# EAGLE board SSS_SOB_REPRO (EAGLE 9.6.2), part 1 of 2
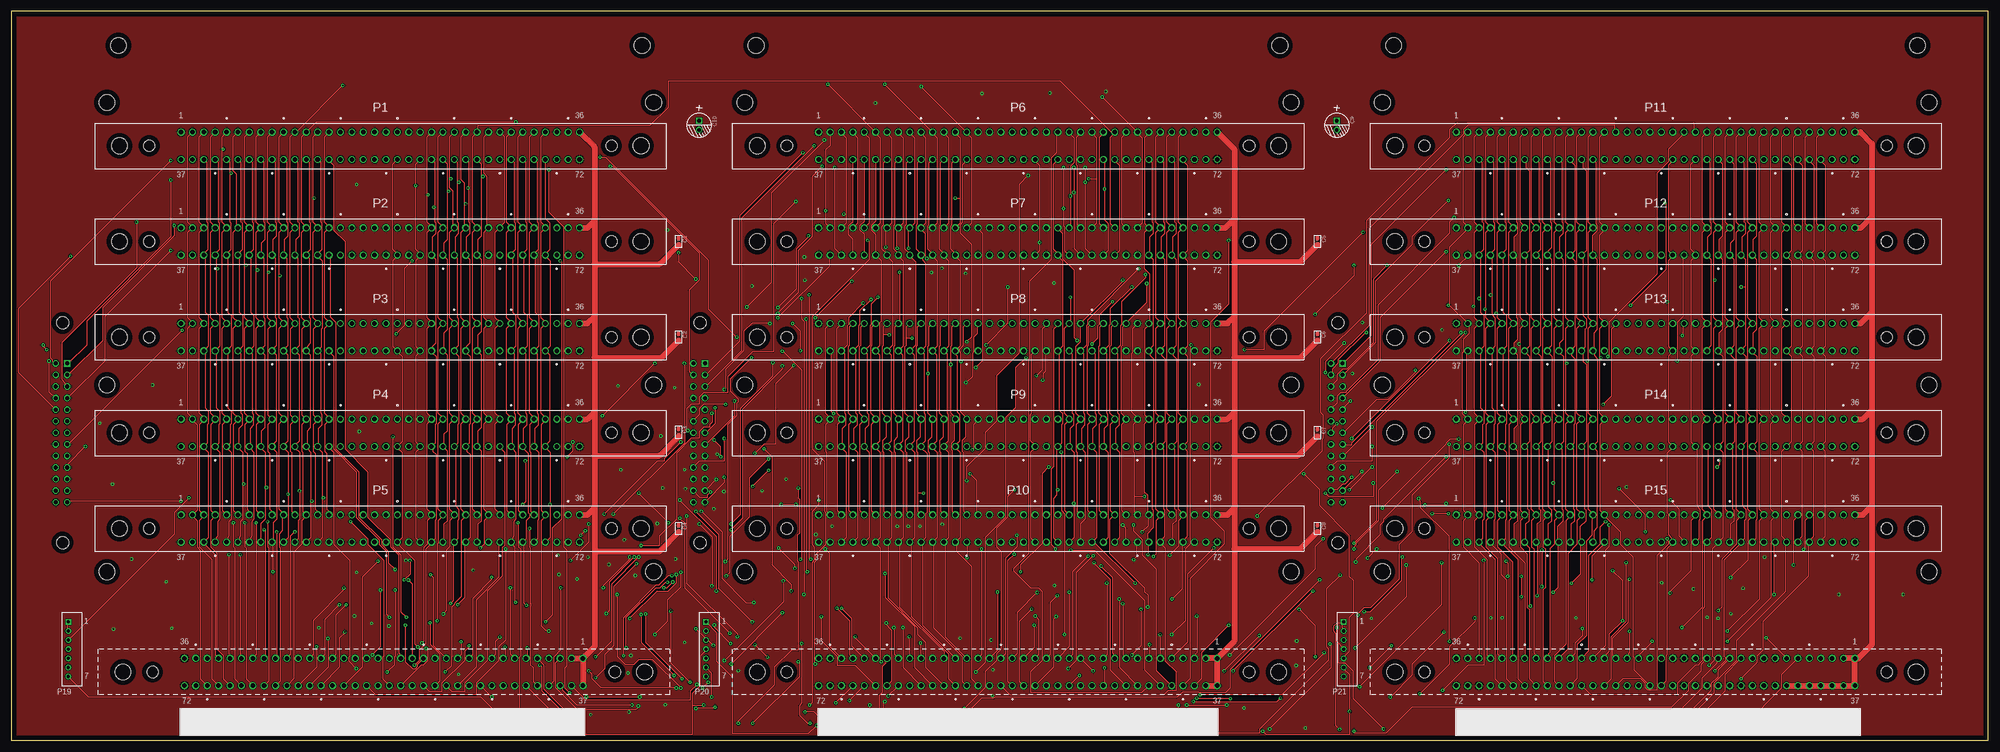
[diagram p3: board, top side]
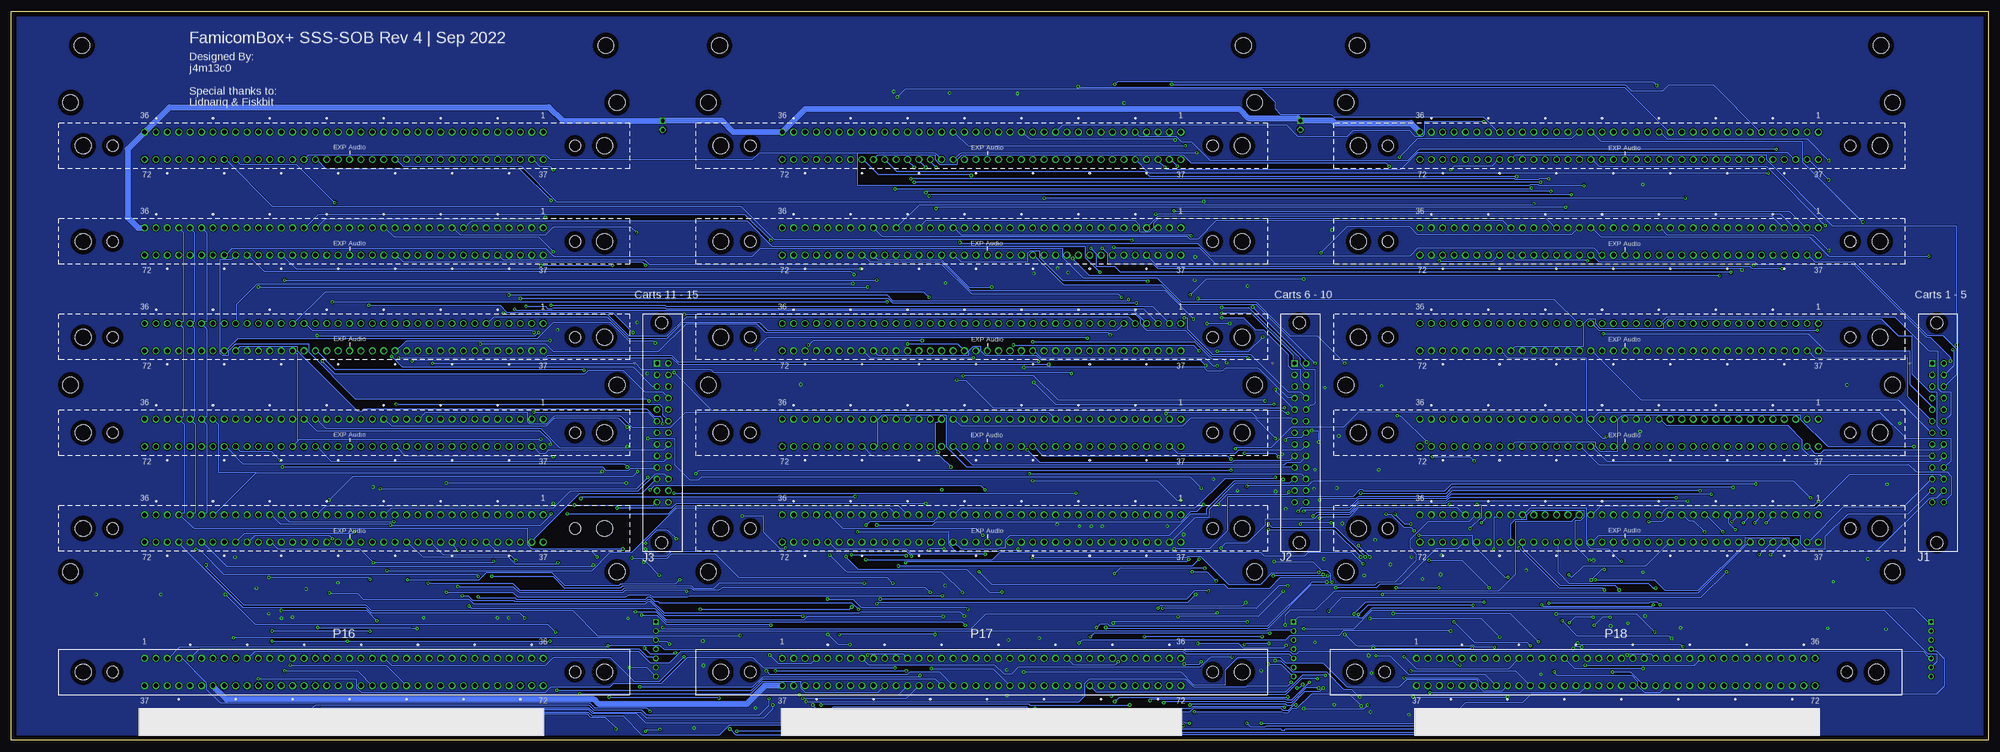
[diagram p4: board, bottom side, seen from below]

Size 434 x 160 mm. Coordinates in mm from the lower left corner, seen from the top.
Outline: 0,0 434,0 434,160 0,160 0,0
Copper layers (1*16): Top 0.035mm / dielectric 1.5mm / Bottom 0.035mm
Design rules "default *": minimum track width 6mil, minimum drill 0.3mm, track to track 6mil, track to pad 6mil, pad to pad 6mil, via to via 6mil, smd to smd 6mil, copper to edge 40mil, drill to drill 6mil, minimum pad ring 10mil, minimum via ring 8mil, stop-mask expansion 4mil, vias tented up to drill 0.3mm, thermal gap 10mil
Holes 3.5 mm at 23.5,152.5 138.5,152.5 163.5,152.5 278.5,152.5 303.5,152.5 418.5,152.5 21,37 21,78 21,140 421,37 421,78 421,140 141,140 141,78 141,37 161,140 161,78 161,37 281,140 281,78 281,37 301,140 301,78 301,37

## Footprints (pad centres in the part's own frame; a part is rotated, then mirrored left to right if it is on the bottom)
C0603 = smd 0.889 x 0.889: 1 0,0.762; 2 0,-0.762
PC-D5.3MM = drill 0.8 pad 1.35 square: + -1,0 | drill 0.8 pad 1.35: - 1,0
TE_2-5499206-6 = drill 0.89 square: 1 -15.24,-1.27 | drill 0.89: 2 -15.24,1.27; 3 -12.7,-1.27; 4 -12.7,1.27; 5 -10.16,-1.27; 6 -10.16,1.27; 7 -7.62,-1.27; 8 -7.62,1.27; 9 -5.08,-1.27; 10 -5.08,1.27; 11 -2.54,-1.27; 12 -2.54,1.27; 13 0,-1.27; 14 0,1.27; 15 2.54,-1.27; 16 2.54,1.27; 17 5.08,-1.27; 18 5.08,1.27; 19 7.62,-1.27; 20 7.62,1.27; 21 10.16,-1.27; 22 10.16,1.27; 23 12.7,-1.27; 24 12.7,1.27; 25 15.24,-1.27; 26 15.24,1.27 | hole 2.69: -24.13,-0.25; 24.13,-0.25
72PIN = drill 1: 1 0,6; 2 2.5,6; 3 5,6; 4 7.5,6; 5 10,6; 6 12.5,6; 7 15,6; 8 17.5,6; 9 20,6; 10 22.5,6; 11 25,6; 12 27.5,6; 13 30,6; 14 32.5,6; 15 35,6; 16 37.5,6; 17 40,6; 18 42.5,6; 19 45,6; 20 47.5,6; 21 50,6; 22 52.5,6; 23 55,6; 24 57.5,6; 25 60,6; 26 62.5,6; 27 65,6; 28 67.5,6; 29 70,6; 30 72.5,6; 31 75,6; 32 77.5,6; 33 80,6; 34 82.5,6; 35 85,6; 36 87.5,6; 37 0,0; 38 2.5,0; 39 5,0; 40 7.5,0; 41 10,0; 42 12.5,0; 43 15,0; 44 17.5,0; 45 20,0; 46 22.5,0; 47 25,0; 48 27.5,0; 49 30,0; 50 32.5,0; 51 35,0; 52 37.5,0; 53 40,0; 54 42.5,0; 55 45,0; 56 47.5,0; 57 50,0; 58 52.5,0; 59 55,0; 60 57.5,0; 61 60,0; 62 62.5,0; 63 65,0; 64 67.5,0; 65 70,0; 66 72.5,0; 67 75,0; 68 77.5,0; 69 80,0; 70 82.5,0; 71 85,0; 72 87.5,0 | hole 2.5: -7,3; 94.5,3 | hole 3.5: 101,3; -13.5,3
7PIN_LED = drill 0.7 square: P$1 2,1.5 | drill 0.7: P$2 4,1.5; P$3 6,1.5; P$4 8,1.5; P$5 10,1.5; P$6 12,1.5; P$7 14,1.5

## Placement (x,y rotation side)
C1  100nf  [C0603]  146.5,109.5 0 top
C2  100nf  [C0603]  146.5,88.5 0 top
C3  100nf  [C0603]  146.5,67.6 0 top
C4  100nf  [C0603]  146.5,46.5 0 top
C5  100nf  [C0603]  286.75,109.5 0 top
C6  100nf  [C0603]  286.75,88.5 0 top
C7  100nf  [C0603]  286.75,67.5 0 top
C8  100nf  [C0603]  286.75,46.5 0 top
C9  220uf 10V  [PC-D5.3MM]  291,135 270 top
C10  220uf 10V  [PC-D5.3MM]  151,135 270 top
J1  2-5499206-6  [TE_2-5499206-6]  11,67.5 270 bottom
J2  2-5499206-6  [TE_2-5499206-6]  151,67.5 270 bottom
J3  2-5499206-6  [TE_2-5499206-6]  291,67.5 270 bottom
P1  CARTRIDGE_CONNECTOR  [72PIN]  37.25,127.5 0 top
P2  CARTRIDGE_CONNECTOR  [72PIN]  37.25,106.5 0 top
P3  CARTRIDGE_CONNECTOR  [72PIN]  37.25,85.5 0 top
P4  CARTRIDGE_CONNECTOR  [72PIN]  37.25,64.5 0 top
P5  CARTRIDGE_CONNECTOR  [72PIN]  37.25,43.5 0 top
P6  CARTRIDGE_CONNECTOR  [72PIN]  177.25,127.5 0 top
P7  CARTRIDGE_CONNECTOR  [72PIN]  177.25,106.5 0 top
P8  CARTRIDGE_CONNECTOR  [72PIN]  177.25,85.5 0 top
P9  CARTRIDGE_CONNECTOR  [72PIN]  177.25,64.5 0 top
P10  CARTRIDGE_CONNECTOR  [72PIN]  177.25,43.5 0 top
P11  CARTRIDGE_CONNECTOR  [72PIN]  317.25,127.5 0 top
P12  CARTRIDGE_CONNECTOR  [72PIN]  317.25,106.5 0 top
P13  CARTRIDGE_CONNECTOR  [72PIN]  317.25,85.5 0 top
P14  CARTRIDGE_CONNECTOR  [72PIN]  317.25,64.5 0 top
P15  CARTRIDGE_CONNECTOR  [72PIN]  317.25,43.5 0 top
P16  P16_CONNECTOR  [72PIN]  404.75,12 0 bottom
P17  P17_CONNECTOR  [72PIN]  264.75,12 0 bottom
P18  P18_CONNECTOR  [72PIN]  125.5,12 0 bottom
P19  LED_BOARD_CONNECTOR  [7PIN_LED]  11,28 270 top
P20  LED_BOARD_CONNECTOR  [7PIN_LED]  151,28 270 top
P21  LED_BOARD_CONNECTOR  [7PIN_LED]  291,28 270 top

## Tracks (layer width: path | path; a pad name or v marks a point on that pad's centre or on a via)
/W_B1  (via drill 0.3)
  Top 0.152: P18.53 90,16.5 90.39,16.5 91.5,17.61 91.5,19.75 v91.1,20.15 | v89.25,20.5 88.5,21.25 88.5,39.5 84.75,43.25 P5.56 85.75,44.5 85.75,63.25 84.75,64.25 P4.56 85.75,65.5 85.75,84.25 84.75,85.25 P3.56 83.75,86.5 83.75,105.25 84.75,106.25 P2.56 84.75,106.75 83.75,107.75 83.75,126.5 P1.56 | P7.56 225.75,107.5 v225.75,109.25 225.75,126.25 224.75,127.25 P6.56
  Bottom 0.152: v91.1,20.15 90.75,20.5 v89.25,20.5 | v225.75,109.25 225.5,109 173.5,109 170.75,106.25 127,106.25 125.25,108 86.5,108 85,106.5 P2.56
/W_B2  (via drill 0.3)
  Top 0.152: P10.56 223.75,44.5 223.75,63.25 224.75,64.25 P9.56 224.75,64.75 223.75,65.75 223.75,71.5 224,71.75 224,84.75 P8.56 | P16.54 363.25,13 363.25,18.5 363.5,18.75 363.5,42 364.75,43.25 P15.56 364.5,43.75 364.5,44.5 363.75,45.25 363.75,49.75 363.5,50 363.5,63 364.75,64.25 P14.56 363.75,65.5 363.75,84.25 364.75,85.25 P13.56 363.75,86.5 363.75,96.25 | P11.56 364.75,127.25 363.75,126.25 363.75,107.5 P12.56 364.75,106.25 363.75,105.25 363.75,96.25 | v237.25,87 238.5,88.25 238.5,91 238.75,91.25 238.75,93.25 v241.75,96.25 | 363.75,96.25 v363.5,96.25
  Bottom 0.152: P8.56 226.25,87 v237.25,87 | v363.5,96.25 v241.75,96.25
A0_B1  (via drill 0.3)
  Top 0.152: P18.27 61.25,18.75 61.25,44.75 v62.25,45.75 | P7.13 208.25,113.5 208.25,119 | 208.25,119 208.25,132.25 207.25,133.25 P6.13 | P1.13 66.25,132.5 66.25,119 | 66.25,119 66.25,113.75 67.25,112.75 P2.13 66.25,111.5 66.25,92.75 67.25,91.75 P3.13 67.25,91.25 66.25,90.25 66.25,71.5 P4.13 67.25,70.25 66.25,69.25 66.25,63.5 66.75,63 66.75,50.75 67,50.5 67,49.75 P5.13 | v207.25,119 208.25,119 | 66.25,119 v66.5,119
  Bottom 0.152: v62.25,45.75 64.75,48.25 65.75,48.25 67,49.5 P5.13 | v66.5,119 v207.25,119
A0_B2  (via drill 0.3)
  Top 0.152: P10.13 206.5,50.25 206.5,63.65 206.25,63.9 206.25,65.05 207,65.8 207,70.25 P9.13 207.25,70.75 206.25,71.75 v206.25,82.5 206.25,86.5 206.5,86.75 206.5,90.75 P8.13 | P16.62 343.75,13.5 343.75,21 345.75,23 345.75,43.75 347,45 347,49.25 P15.13 347.25,49.75 346.25,50.75 346.25,69.5 P14.13 347.25,70.75 346.25,71.75 346.25,83.25 | 346.25,83.25 346.25,90.5 P13.13 347.25,91.75 346.25,92.75 346.25,111.5 P12.13 347.25,112.75 346.25,113.75 346.25,132.5 P11.13 | 346.25,83.25 v346,83.25
  Bottom 0.152: v206.25,82.5 287.5,82.5 289,84 316.25,84 316.75,83.5 345.75,83.5 v346,83.25
A1_B1  (via drill 0.3)
  Top 0.152: P18.63 62,13.5 62,41.25 63.75,43 63.75,48.25 64.75,49.25 P5.12 64,50.25 64,63.25 63.75,63.5 63.75,69.25 64.75,70.25 P4.12 63.75,71.5 63.75,90.25 64.75,91.25 P3.12 64.75,91.75 63.75,92.75 63.75,111.5 P2.12 64.75,112.75 63.75,113.75 63.75,132.5 P1.12 67,135.75 v110.75,135.75 | P7.12 205.75,113.5 205.75,132.25 204.75,133.25 P6.12
  Bottom 0.152: P6.12 203.25,135 154,135 151.5,132.5 140.75,132.5 139.5,133.75 127,133.75 125.75,132.5 124.25,132.5 123.75,133 123.75,135.75 v110.75,135.75
A1_B2
  Top 0.152: P10.12 204,50.25 204,63.25 203.75,63.5 203.75,65.75 204.5,66.5 204.5,70.25 P9.12 204.75,70.75 203.75,71.75 203.75,86.5 204,86.75 204,90.75 P8.12 | P16.27 341.75,20 341.75,41 343.75,43 343.75,48.25 344.75,49.25 P15.12 344.75,49.75 343.75,50.75 343.75,69.5 P14.12 344.75,70.75 343.75,71.75 343.75,90.5 P13.12 344.75,91.75 343.75,92.75 343.75,111.5 P12.12 344.75,112.75 343.75,113.75 343.75,132.5 P11.12
  Bottom 0.152: P9.12 206.25,72 286,72 289.25,68.75 297.75,68.75 300.25,71.25 314.75,71.25 316.5,69.5 320.25,69.5 320.75,70 320.75,72 343,72 344.5,70.5 P14.12
A2_B1  (via drill 0.3)
  Top 0.152: P18.28 58.25,18.25 v58.25,45.75 | P7.11 203.25,113.5 203.25,132.25 202.25,133.25 P6.11 v191.75,144 | v72.75,143.75 62.5,133.5 P1.11 61.25,132.5 61.25,113.75 62.25,112.75 P2.11 61.25,111.5 61.25,92.75 62.25,91.75 P3.11 62.25,91.25 61.25,90.25 61.25,71.5 P4.11 62.25,70.25 61.25,69.25 61.25,63.5 61.5,63.25 61.5,50.25 P5.11
  Bottom 0.152: v58.25,45.75 62,49.5 P5.11 | v72.75,143.75 73.4,144.4 178.79,144.4 179,144.61 191.14,144.61 v191.75,144
A2_B2  (via drill 0.3)
  Top 0.152: P10.11 201.5,50.25 201.5,63.25 201.25,63.5 201.25,65.75 202,66.5 202,70.25 P9.11 202.25,70.75 201.25,71.75 v201.25,80.5 201.25,86.5 201.5,86.75 201.5,90.75 P8.11 | P16.63 338.75,13 338.75,18.55 341.25,21.05 341.25,48.25 342.25,49.25 P15.11 342.25,49.75 341.25,50.75 341.25,69.5 P14.11 342.25,70.75 341.25,71.75 341.25,82.75 | 341.25,82.75 341.25,90.5 P13.11 342.25,91.75 341.25,92.75 341.25,111.5 P12.11 342.25,112.75 341.25,113.75 341.25,132.5 P11.11 | 341.25,82.75 v341.5,82.75
  Bottom 0.152: v201.25,80.5 201.55,80.8 279.8,80.8 280.5,81.5 295.75,81.5 297,82.75 v341.5,82.75
A3_B1  (via drill 0.3)
  Top 0.152: P6.10 199.75,133.25 200.75,132.25 200.75,113.5 P7.10 199.75,112.2 200.75,111.2 200.75,106.25 201,106 v201,105.75 | P18.64 59,13 59,42.25 58.75,42.5 58.75,45.25 59.5,46 59.5,49.25 P5.10 59.75,49.75 58.75,50.75 58.75,69.5 P4.10 59.75,70.75 58.75,71.75 58.75,90.5 P3.10 59.75,91.75 58.75,92.75 58.75,102 | 58.75,102 58.75,111.5 P2.10 59.75,112.75 58.75,113.75 58.75,132.5 P1.10 | 58.75,102 v59,102
  Bottom 0.152: v201,105.75 197.25,102 v59,102
A3_B2  (via drill 0.3)
  Top 0.152: P10.10 199,50.25 199,54.25 | 199,54.25 199,63.25 198.75,63.5 198.75,65.75 199.5,66.5 199.5,70.25 P9.10 199.75,70.75 198.75,71.75 198.75,86.5 199,86.75 199,90.75 P8.10 | P16.28 337.5,18.25 337.5,19 337.75,19.25 337.75,42 338.75,43 338.75,48.25 339.75,49.25 P15.10 339.75,49.75 338.75,50.75 338.75,56.5 | 338.75,56.5 338.75,69.5 P14.10 339.75,70.75 338.75,71.75 338.75,90.5 P13.10 339.75,91.75 338.75,92.75 338.75,111.5 P12.10 339.75,112.75 338.75,113.75 338.75,132.5 P11.10 | v200.25,54.25 199,54.25 | v288.5,54.25 289.25,53.5 299,53.5 v299,56.5 | 338.75,56.5 v338.5,56.5
  Bottom 0.152: v288.5,54.25 v200.25,54.25 | v338.5,56.5 v299,56.5
A4_B1  (via drill 0.3)
  Top 0.152: P18.29 55.75,18.25 55.75,46 v55.5,46.25 | P6.9 197.25,133.25 198.25,132.25 198.25,113.5 P7.9 197,112.25 v197,108 | 56.25,102.75 56.25,92.75 57.25,91.75 P3.9 57.25,91.25 56.25,90.25 56.25,71.5 P4.9 57.25,70.25 56.25,69.25 56.25,63.5 56.75,63 56.75,50.75 57,50.5 57,49.75 P5.9 | 56.25,102.75 56.25,111.5 P2.9 57.25,112.75 56.25,113.75 56.25,132.5 P1.9 | 56.25,102.75 v56.5,102.75
  Bottom 0.152: v55.5,46.25 57,47.75 57,49.5 P5.9 | v197,108 195.75,106.75 195.75,104 191.75,104 190.5,102.75 v56.5,102.75
A4_B2  (via drill 0.3)
  Top 0.152: P10.9 196.5,50.25 196.5,63.25 196.25,63.5 196.25,65.75 197,66.5 197,70.25 P9.9 197.25,70.75 196.25,71.75 196.25,86.5 196.5,86.75 196.5,88.25 | P8.9 196.5,90.75 196.5,88.25 | P16.64 336.25,13 336.25,33 336.75,33.5 336.75,42 336.25,42.5 336.25,48.25 337.25,49.25 P15.9 337.25,49.75 336.25,50.75 336.25,69.5 P14.9 337.25,70.75 336.25,71.75 336.25,90.5 P13.9 337.25,91.75 336.25,92.75 336.25,111.5 P12.9 337.25,112.75 336.25,113.75 336.25,132.5 P11.9 | v197.75,88.25 196.5,88.25 | v270.75,85.75 275,85.75 275,89.75 v296.75,111.5
  Bottom 0.152: v197.75,88.25 198,88.5 268,88.5 v270.75,85.75 | v296.75,111.5 298,112.75 315,112.75 316.75,111 335.5,111 337,112.5 P12.9
A5_B1  (via drill 0.3)
  Top 0.152: P6.8 194.75,133.25 195.75,132.25 195.75,113.5 P7.8 194.5,112.25 v194.5,108 | P5.8 53.75,50.5 53.75,69.25 54.75,70.25 P4.8 54.75,70.75 53.75,71.75 53.75,90.5 P3.8 54.75,91.75 53.75,92.75 53.75,103.25 | 53.75,103.25 53.75,111.5 P2.8 54.75,112.75 53.75,113.75 53.75,132.5 P1.8 | P18.65 56.5,13 56.5,42.25 56.25,42.5 v56.25,48 | 53.75,103.25 v54,103.25
  Bottom 0.152: P5.8 v56.25,48 | v194.5,108 193.25,106.75 193.25,104.5 183.25,104.5 182.25,103.5 54.25,103.5 v54,103.25
A5_B2  (via drill 0.3)
  Top 0.152: P10.8 194,50.25 194,63.25 193.75,63.5 193.75,65.75 194.5,66.5 194.5,70.25 P9.8 194.75,70.75 193.75,71.75 193.75,86.5 194,86.75 194,90.75 P8.8 195,91.75 v195,102.75 | P16.29 334.5,18.25 334.5,19 334.25,19.25 334.25,42 333.75,42.5 333.75,48.25 334.75,49.25 P15.8 334.75,49.75 333.75,50.75 333.75,69.5 P14.8 334.75,70.75 333.75,71.75 333.75,90.5 P13.8 334.75,91.75 333.75,92.75 333.75,111.5 P12.8 334.75,112.75 333.75,113.75 333.75,132.5 P11.8
  Bottom 0.152: v195,102.75 198.25,106 198.25,108.5 267,108.5 272.5,114 333,114 334.5,112.5 P12.8
A6_B1  (via drill 0.3)
  Top 0.152: P6.7 192.25,133.25 193.25,132.25 193.25,113.5 P7.7 192,112.25 v192,108.25 | P5.7 52,49.75 52,50.5 51.75,50.75 51.75,63 51.25,63.5 51.25,69.25 52.25,70.25 P4.7 52.25,70.75 51.25,71.75 51.25,90.5 P3.7 52.25,91.75 51.25,92.75 51.25,104.25 | 51.25,104.25 51.25,111.5 P2.7 52.25,112.75 51.25,113.75 51.25,132.5 P1.7 | P18.30 53.75,18.75 v53.75,47.75 | 51.25,104.25 v51.5,104.25
  Bottom 0.152: v53.75,47.75 52.25,49.25 P5.7 | v192,108.25 191.75,108 173,108 169.5,104.5 51.75,104.5 v51.5,104.25
A6_B2  (via drill 0.3)
  Top 0.152: P10.7 191.5,50.25 191.5,63.25 191.25,63.5 191.25,65.75 192,66.5 192,70.25 P9.7 192.25,70.75 191.25,71.75 191.25,86.5 191.5,86.75 191.5,89 | P8.7 191.5,90.75 191.5,89 | 331.25,87 331.25,71.75 332.25,70.75 P14.7 332.25,70.25 331.25,69.25 331.25,50.5 P15.7 332.25,49.25 331.25,48.25 331.25,42.5 332.75,41 332.75,29.25 333.25,28.75 333.25,13.5 P16.65 | 331.25,87 331.25,90.5 P13.7 332.25,91.75 331.25,92.75 331.25,111.5 P12.7 332.25,112.75 331.25,113.75 331.25,132.5 P11.7 | v192.75,89 191.5,89 | 331.25,87 v331,87
  Bottom 0.152: v192.75,89 193.25,89.5 268.44,89.5 270.28,91.34 285.91,91.34 292,85.25 315,85.25 316.75,87 v331,87
A7_B1  (via drill 0.3)
  Top 0.152: P7.6 190.75,113.5 190.75,132.25 189.75,133.25 P6.6 v179.25,144 | P5.6 48.75,50.5 48.75,69.25 49.75,70.25 P4.6 49.75,70.75 48.75,71.75 48.75,90.5 P3.6 49.75,91.75 48.75,92.75 48.75,111.5 49.5,112.25 | P1.6 48.75,132.5 48.75,125 49.5,124.25 49.5,112.25 | 49.5,112.25 P2.6 | P18.66 51.5,13.5 51.5,42.25 51.25,42.5 v51.25,47.75
  Bottom 0.152: v51.25,47.75 49.75,49.25 P5.6 | v179.25,144 179,143.75 79.5,143.75 78.25,142.5 71.5,142.5 70.25,143.75 60.25,143.75 50,133.5 P1.6
A7_B2
  Top 0.152: P10.6 188.75,50.5 188.75,69.25 189.75,70.25 P9.6 189.75,70.75 188.75,71.75 188.75,86.5 189,86.75 189,90.75 P8.6 | P11.6 328.75,132.5 328.75,113.75 329.75,112.75 P12.6 328.75,111.5 328.75,92.75 329.75,91.75 P13.6 328.75,90.5 328.75,71.75 329.75,70.75 P14.6 329.75,70.25 328.75,69.25 328.75,50.5 P15.6 329.75,49.25 328.75,48.25 328.75,42.5 332.25,39 P16.30
  Bottom 0.152: P8.6 191.25,90 268,90 269.75,91.75 286.5,91.75 290,88.25 298.5,88.25 303.25,93 328,93 329.5,91.5 P13.6
A8_B1  (via drill 0.3)
  Top 0.152: P7.5 188.25,113.5 188.25,132.25 187.25,133.25 P6.5 | P5.5 46.25,50.5 46.25,69.25 47.25,70.25 P4.5 47.25,70.75 46.25,71.75 46.25,90.5 P3.5 47.25,91.75 46.25,92.75 46.25,111.5 P2.5 47.25,112.75 46.25,113.75 46.25,129.75 | P1.5 46.25,132.5 46.25,129.75 | P18.67 49,13.5 49,42.25 48.75,42.5 v48.75,47.75 | 46.25,129.75 v46.5,129.75
  Bottom 0.152: v48.75,47.75 47.25,49.25 P5.5 | P6.5 186.25,132.5 178.25,132.5 177,131.25 174.75,131.25 170.75,127.25 127.5,127.25 125,129.75 v46.5,129.75
A8_B2  (via drill 0.3)
  Top 0.152: P10.5 186.25,50.5 186.25,69.25 187.25,70.25 P9.5 187.25,70.75 186.25,71.75 186.25,86.5 186.5,86.75 186.5,90.75 P8.5 | 326.25,93.75 326.25,92.75 327.25,91.75 P13.5 326.25,90.5 326.25,71.75 327.25,70.75 P14.5 327.25,70.25 326.25,69.25 326.25,50.5 P15.5 327.25,49.25 326.25,48.25 326.25,42.5 329.5,39.25 329.5,18.25 P16.31 | 326.25,93.75 326.25,111.5 P12.5 327.25,112.75 326.25,113.75 326.25,132.5 P11.5 | 326.25,93.75 v326,93.75
  Bottom 0.152: P8.5 188.75,93 285.75,93 290,88.75 298.5,88.75 303.25,93.5 325.75,93.5 v326,93.75
A9_B1
  Top 0.152: P7.4 185.75,113.5 185.75,132.25 184.75,133.25 P6.4 | P1.4 43.75,132.5 43.75,113.75 44.75,112.75 P2.4 43.75,111.5 43.75,92.75 44.75,91.75 P3.4 43.75,90.5 43.75,71.75 44.75,70.75 P4.4 44.75,70.25 43.75,69.25 43.75,50.5 P5.4 44.75,49.25 43.75,48.25 43.75,42.5 45.08,41.17 45.08,20.12 46.5,18.7 46.5,13.5 P18.68
  Bottom 0.152: P7.4 182.25,115 47.5,115 45,112.5 P2.4
A9_B2  (via drill 0.3)
  Top 0.152: P10.4 183.75,50.5 183.75,69.25 184.75,70.25 P9.4 184.75,70.75 183.75,71.75 183.75,86.5 184,86.75 184,90.75 P8.4 | 323.75,94.65 323.75,92.75 324.75,91.75 P13.4 323.75,90.5 323.75,71.75 324.75,70.75 P14.4 324.75,70.25 323.75,69.25 323.75,50.5 P15.4 324.75,49.25 323.75,48.25 323.75,42.5 326.25,40 326.25,19 P16.32 | 323.75,94.65 323.75,111.5 P12.4 324.75,112.75 323.75,113.75 323.75,132.5 P11.4 | 323.75,94.65 v323.5,94.65
  Bottom 0.152: P8.4 187.6,94.35 323.2,94.35 v323.5,94.65
A10_B1  (via drill 0.3)
  Top 0.152: P7.3 183.25,113.5 183.25,115.5 | 183.25,115.5 183.25,132.25 182.25,133.25 P6.3 | P1.3 41.25,132.5 41.25,113.75 42.25,112.75 P2.3 41.25,111.5 41.25,92.75 42.25,91.75 P3.3 41.25,90.5 41.25,71.75 42.25,70.75 P4.3 42.25,70.25 41.25,69.25 41.25,50.5 P5.3 42.25,49.25 41.25,48.25 41.25,42.5 44,39.75 44,13.5 P18.69 | v182.75,115.5 183.25,115.5
  Bottom 0.152: v182.75,115.5 45.5,115.5 42.5,112.5 P2.3
A10_B2  (via drill 0.3)
  Top 0.152: P10.3 181.25,50.5 181.25,69.25 182.25,70.25 P9.3 182.25,70.75 181.25,71.75 181.25,90.5 P8.3 | P16.33 324,18.75 324,39.75 321.25,42.5 321.25,48.25 322.25,49.25 P15.3 321.25,50.5 321.25,69.25 322.25,70.25 P14.3 322.25,70.75 321.25,71.75 321.25,90.5 P13.3 322.25,91.75 321.25,92.75 321.25,95.25 | 321.25,95.25 321.25,111.5 P12.3 322.25,112.75 321.25,113.75 321.25,132.5 P11.3 | 321.25,95.25 v321,95.25
  Bottom 0.152: P8.3 185.5,94.75 290.25,94.75 290.5,95 315,95 315.25,94.75 316.25,94.75 316.75,95.25 v321,95.25
A11_B1  (via drill 0.3)
  Top 0.152: P7.2 178.75,113.5 v178.75,116.25 178.75,129.6 179.7,130.55 179.7,133.45 P6.2 | P1.2 38.75,132.5 38.75,113.75 39.75,112.75 P2.2 38.75,111.5 38.75,92.75 39.75,91.75 P3.2 38.75,90.5 38.75,71.75 39.75,70.75 P4.2 39.75,70.25 40.75,69.25 40.75,50.5 P5.2 39.75,49.25 40.75,48.25 40.75,42.5 41.5,41.75 41.5,13.5 P18.70
  Bottom 0.152: v178.75,116.25 178.5,116 43.5,116 40,112.5 P2.2
A11_B2  (via drill 0.3)
  Top 0.152: P16.34 322.25,39 318.75,42.5 318.75,48.25 319.75,49.25 P15.2 318.75,50.5 318.75,69.25 319.75,70.25 P14.2 318.5,71.75 318.5,85 318.75,85.25 318.75,88 320,89.25 320,91.25 P13.2 315.75,95.5 | P10.2 179,50.25 179,63.25 178.75,63.5 178.75,69.25 179.75,70.25 P9.2 179.75,70.75 178.75,71.75 178.75,90.5 P8.2 | 315.75,95.5 315.75,108.25 319.75,112.25 P12.2 319.75,112.75 318.75,113.75 318.75,132.5 P11.2 | 315.75,95.5 v315.5,95.5
  Bottom 0.152: P8.2 183.5,95.25 290.25,95.25 290.5,95.5 v315.5,95.5
A12_B1  (via drill 0.3)
  Top 0.152: P18.33 44.75,18.75 44.75,40.75 42.25,43.25 P5.39 43.25,44.5 43.25,63.25 42.25,64.25 P4.39 43,65.25 43,69.25 43.25,69.5 43.25,72.25 42.5,73 42.5,85.75 | P7.39 180.75,108 v180.75,125.75 | 42.5,85.75 43.25,86.5 43.25,93.25 42.5,94 42.5,106.25 P2.39 42.25,106.75 43.25,107.75 43.25,113.5 43,113.75 43,126.75 P1.39 | 42.5,85.75 P3.39
  Bottom 0.152: P6.39 182.25,127.25 v180.75,125.75 180.25,125.25 129,125.25 125.25,129 44,129 42.5,127.5 P1.39
A12_B2  (via drill 0.3)
  Top 0.152: P16.68 325.75,13.5 325.75,39.75 322.25,43.25 P15.39 323,44.25 323,48.25 323.25,48.5 323.25,63.25 322.25,64.25 P14.39 323,65.25 323,69.25 323.25,69.5 323.25,72.25 322.5,73 322.5,85.75 | P10.39 183.25,44.5 183.25,63.25 182.5,64 | 182.5,64 182.25,64.25 P9.39 182.5,64 | 182.5,64 182.5,68.5 183.25,69.25 183.25,71.5 183,71.75 183,84.75 P8.39 183.5,86.75 183.5,91 183.75,91.25 183.75,92.75 v187,96 | 322.5,85.75 323.25,86.5 323.25,93.25 322.5,94 322.5,97 | 322.5,97 322.5,106.25 P12.39 322.25,106.75 323.25,107.75 323.25,113.5 323,113.75 323,126.75 P11.39 | 322.5,97 v322.25,97 | 322.5,85.75 P13.39
  Bottom 0.152: v187,96 240.5,96 241.5,97 v322.25,97
A13_B1  (via drill 0.3)
  Top 0.152: P5.40 45,43.75 45,44.5 45.25,44.75 45.25,48 45.75,48.5 45.75,63.25 44.75,64.25 P4.40 45.5,65.25 45.5,69.25 45.75,69.5 45.75,72.25 45,73 45,85.75 | P18.32 47.75,18.25 v47.75,40.75 | P7.40 184.65,106.6 184.65,110.1 183.7,111.05 183.7,112.84 184.34,113.48 184.43,113.48 184.65,113.7 184.65,127.15 184.75,127.25 P6.40 | 45,85.75 45.75,86.5 45.75,93.25 45,94 45,103.5 | 45,103.5 45,106.25 P2.40 44.75,106.75 45.75,107.75 45.75,113.5 45.5,113.75 45.5,126.75 P1.40 | 45,103.5 v45.25,103.5 | 45,85.75 P3.40
  Bottom 0.152: v47.75,40.75 45,43.5 P5.40 | P7.40 182.25,104 52.25,104 51.75,103.5 v45.25,103.5
A13_B2  (via drill 0.3)
  Top 0.152: P16.67 328.25,13.5 328.25,35.25 327,36.5 327,41 324.75,43.25 P15.40 325.5,44.25 325.5,48.25 325.75,48.5 325.75,63.25 324.75,64.25 P14.40 325.5,65.25 325.5,69.25 325.75,69.5 325.75,72.25 325,73 325,85.75 | P10.40 185.75,44.5 185.75,63.25 185,64 | 185,64 184.75,64.25 P9.40 185,64 | 185,64 185,68.5 185.75,69.25 185.75,71.5 185.5,71.75 185.5,84.75 P8.40 186,86.75 186,91 186.25,91.25 186.25,94.25 v188.75,96.75 | 325,85.75 325.75,86.5 325.75,92.75 325,93.5 325,97.75 | 325,97.75 325,106.25 P12.40 324.75,106.75 325.75,107.75 325.75,113.5 325.5,113.75 325.5,126.75 P11.40 | 325,97.75 v324.75,97.75 | 325,85.75 P13.40
  Bottom 0.152: v188.75,96.75 189,96.5 240.5,96.5 241.75,97.75 v324.75,97.75
A14_B1  (via drill 0.3)
  Top 0.152: P5.41 47.5,43.75 47.5,44.5 47.75,44.75 47.75,48 48.25,48.5 48.25,63.25 47.25,64.25 P4.41 48,65.25 48,69.25 48.25,69.5 48.25,72.25 47.5,73 47.5,85.75 | P18.31 50.25,18.25 v50.25,40.75 | P7.41 187.15,106.6 187.15,111.21 186.27,112.09 186.27,112.91 187.15,113.79 187.15,127.15 187.25,127.25 P6.41 | 47.5,85.75 48.25,86.5 48.25,93.25 47.5,94 47.5,106.25 P2.41 47.25,106.75 48.25,107.75 48.25,113.5 48,113.75 48,124.5 | P1.41 48,126.75 48,124.5 | 48,124.5 v48.25,124.5 | 47.5,85.75 P3.41
  Bottom 0.152: v50.25,40.75 47.5,43.5 P5.41 | P6.41 184.25,124.5 v48.25,124.5
A14_B2  (via drill 0.3)
  Top 0.152: P16.66 330.75,13.5 330.75,39.75 327.25,43.25 P15.41 328,44.25 328,48.25 328.25,48.5 328.25,63.25 327.25,64.25 P14.41 328,65.25 328,69.25 328.25,69.5 328.25,72.25 327.5,73 327.5,85.75 | P10.41 188.25,44.5 188.25,63.25 187.5,64 | 187.5,64 187.25,64.25 P9.41 187.5,64 | 187.5,64 187.5,68.5 188.25,69.25 188.25,71.5 188,71.75 188,84.75 P8.41 188.5,86.75 188.5,91 188.75,91.25 188.75,95.75 v190.25,97.25 | 327.5,85.75 328.25,86.5 328.25,93.25 327.5,94 327.5,106.25 P12.41 327.25,106.75 328.25,107.75 328.25,113.5 328,113.75 328,126.75 P11.41 | 327.5,85.75 P13.41
  Bottom 0.152: v190.25,97.25 191,98 223.25,98 229.75,104.5 294,104.5 295,105.5 326,105.5 327,106.5 P12.41
BL0_D0  (via drill 0.3)
  Top 0.152: P1.49 68,126.75 68,113.75 68.25,113.5 68.25,107.75 67.25,106.75 P2.49 67.25,106.25 68.25,105.25 68.25,90.5 68,90.25 68,86.25 P3.49 68,84.75 68,71.75 68.25,71.5 68.25,69.25 67.5,68.5 67.5,64 | P5.49 68.25,44.5 68.25,53.25 | 68.25,53.25 68.25,63.25 67.5,64 | 67.5,64 67.25,64.25 P4.49 67.5,64 | P17.66 193.25,13 193.25,24.2 192.1,25.35 v192.1,25.75 | v162.65,26 155.25,33.4 155.25,45.25 v150.25,50.25 | 68.25,53.25 v68.5,53.25
  Bottom 0.152: v192.1,25.75 191.85,26 v162.65,26 | v150.25,50.25 150,50.5 140.25,50.5 138.25,52.5 119,52.5 118.25,53.25 v68.5,53.25
BL0_D1  (via drill 0.3)
  Top 0.152: P5.48 65.75,44.5 65.75,52.5 | 65.75,52.5 65.75,63.25 65,64 | 65,64 64.75,64.25 P4.48 65,64 | P17.31 185.25,22.5 v185.25,22.75 | v159.4,22.75 159.4,23.35 148.25,34.5 v148.25,49.25 | 65.75,52.5 v66,52.5 | 65,85.25 65.75,84.5 65.75,68.75 65,68 65,64 | 65,85.25 65,86.5 65.75,87.25 65.75,92.5 65.5,92.75 65.5,105.75 P2.48 64.75,106.75 65.75,107.75 65.75,113.5 65.5,113.75 65.5,126.75 P1.48 | 65,85.25 P3.48
  Bottom 0.152: v159.4,22.75 v185.25,22.75 | v148.25,49.25 147.5,50 140.25,50 138.25,52 119,52 118.5,52.5 v66,52.5
BL0_D2  (via drill 0.3)
  Top 0.152: P5.47 63,44.25 63,48.25 63.25,48.5 v63.25,54.75 63.25,63.25 62.25,64.25 P4.47 62.25,64.75 63.25,65.75 63.25,84.5 P3.47 62.25,85.75 63.25,86.75 63.25,92.5 63,92.75 63,105.75 62.5,106.25 | P17.67 185.25,16.5 181.25,16.5 181.25,18.5 177.8,21.95 v177.8,27.15 | v154.75,32.75 154.75,44.75 v146.75,52.75 | P1.47 63,126.75 63,113.75 63.25,113.5 63.25,110.75 62.5,110 62.5,106.25 | 62.5,106.25 P2.47
  Bottom 0.152: v177.8,27.15 177.7,27.25 160.25,27.25 v154.75,32.75 | v146.75,52.75 146.5,53 138.75,53 138.25,53.5 119,53.5 117.75,54.75 v63.25,54.75
BL0_D3  (via drill 0.3)
  Top 0.152: P5.46 60.75,44.5 v60.75,54 60.75,63.25 59.75,64.25 P4.46 59.75,64.75 60.75,65.75 60.75,84.5 P3.46 59.75,85.75 60.75,86.75 60.75,92.5 60.5,92.75 60.5,105.75 60,106.25 | P17.32 184.5,20.75 184.5,26.75 v182.25,29 | v163,30.25 161.3,30.25 156,35.55 156,45.75 v151.5,50.25 | P1.46 60.5,126.75 60.5,113.75 60.75,113.5 60.75,110.75 60,110 60,106.25 | 60,106.25 P2.46
  Bottom 0.152: v163,30.25 163.8,29.45 180.88,29.45 181.01,29.58 181.67,29.58 v182.25,29 | v151.5,50.25 150.75,51 140.25,51 138.25,53 119,53 118,54 v60.75,54
BL0_D4  (via drill 0.3)
  Top 0.152: v184,8.75 P17.68 | v149,12.75 144.75,17 v144.75,28.35 | 57.4,43.65 v57.4,37 | 57.4,43.65 57.5,43.75 57.5,47.75 58.25,48.5 58.25,63.25 57.25,64.25 P4.45 57.25,64.75 58.25,65.75 58.25,84.5 P3.45 57.25,85.75 58.25,86.75 58.25,92.5 58,92.75 58,105.75 57.5,106.25 | 57.4,43.65 P5.45 | P1.45 58,126.75 58,113.75 58.25,113.5 58.25,110.75 57.5,110 57.5,106.25 | 57.5,106.25 P2.45
  Bottom 0.152: v184,8.75 183.75,9 154.25,9 154,8.75 153,8.75 v149,12.75 | v144.75,28.35 144.75,28.45 141.95,31.25 63.15,31.25 v57.4,37
BL0_D5  (via drill 0.3)
  Top 0.152: P5.44 54.75,47.5 55.75,48.5 55.75,55.5 | 55.75,55.5 55.75,63.25 55,64 | 55,64 54.75,64.25 P4.44 55,64 | P17.33 184,18.75 184,26.25 v181.25,29 | v153.8,33.9 153.8,44.7 v151,47.5 | v137.75,54.25 v144.25,47.75 | 55.75,55.5 v56,55.5 | 55,64 55,68 55.75,68.75 55.75,84.5 P3.44 54.75,85.75 55.75,86.75 55.75,92.5 55.5,92.75 55.5,105.75 55,106.25 | P1.44 55.5,126.75 55.5,113.75 55.75,113.5 55.75,110 55,109.25 55,106.25 | 55,106.25 P2.44
  Bottom 0.152: v181.25,29 160.6,29 155.7,33.9 v153.8,33.9 | v151,47.5 150.75,47.75 v144.25,47.75 | v56,55.5 117.7,55.5 119.1,54.1 137.6,54.1 v137.75,54.25
BL0_D6  (via drill 0.3)
  Top 0.152: P1.43 53,126.75 53,113.75 53.25,113.5 53.25,107.75 52.25,106.75 P2.43 52.5,106.25 52.5,94 53.25,93.25 53.25,86.5 P3.43 53,84.75 53,71.75 53.25,71.5 53.25,69.25 52.5,68.5 52.5,64 | P5.43 52.5,43.75 52.5,44.5 52.75,44.75 52.75,48 53.25,48.5 53.25,63.25 52.5,64 | 52.5,64 52.25,64.25 P4.43 52.5,64 | v181,8.25 P17.69 | v133,32 133,18.4 134.69,16.71 136.69,16.71 137.82,17.84 140.66,17.84 v147,11.5
  Bottom 0.152: v181,8.25 180.75,8.5 154.25,8.5 154,8.25 153,8.25 149.75,11.5 v147,11.5 | v133,32 132.75,32.25 63.75,32.25 52.5,43.5 P5.43
BL0_D7  (via drill 0.3)
  Top 0.152: P1.42 50.5,126.75 50.5,113.75 50.75,113.5 50.75,107.75 49.75,106.75 P2.42 50,106.25 50,94 50.75,93.25 50.75,86.5 P3.42 50.5,84.75 50.5,71.75 50.75,71.5 50.75,69.25 50,68.5 50,64 | P5.42 50,43.75 50,44.5 50.25,44.75 50.25,48 50.75,48.5 50.75,56.25 | 50.75,56.25 50.75,63.25 50,64 | 50,64 49.75,64.25 P4.42 50,64 | 50.75,56.25 v51,56.25 | v178.7,42 179.5,41.2 179.5,20.75 P17.34
  Bottom 0.152: v178.7,42 171,42 167,46 167,53.5 139.5,53.5 138,55 137.3,55 137,54.7 119.35,54.7 117.8,56.25 v51,56.25
BL0_PD0  (via drill 0.3)
  Top 0.152: P5.30 108.75,50.5 108.75,69.25 109.75,70.25 P4.30 109.75,70.75 108.75,71.75 108.75,90.5 P3.30 109.75,91.75 108.75,92.75 108.75,111.5 P2.30 109.75,112.75 108.75,113.75 108.75,132.5 P1.30 | P17.30 192,17.75 192,17 191.25,16.25 191.25,10.55 190.6,9.9 190.6,5.1 v187.5,2 | v111.65,2.8 111.5,2.95 111.5,18.25 111.75,18.5 111.75,42 111.25,42.5 v111.25,47.75
  Bottom 0.152: v187.5,2 186.75,1.25 113.2,1.25 v111.65,2.8 | v111.25,47.75 109.75,49.25 P5.30
BL0_PD1  (via drill 0.3)
  Top 0.152: P5.31 111.25,50.5 111.25,69.25 112.25,70.25 P4.31 112.25,70.75 111.25,71.75 111.25,90.5 P3.31 112.25,91.75 111.25,92.75 111.25,111.5 P2.31 112.25,112.75 111.25,113.75 111.25,132.5 P1.31 | P17.29 193.75,19 v193.75,24.75
  Bottom 0.152: v193.75,24.75 193.5,24.5 158.25,24.5 148.75,34 143.57,34 143.49,34.08 143.01,34.08 142.93,34 134.7,34 133.95,34.75 130.25,34.75 125.6,39.4 125.6,41 127,42.4 127,44 123,48 114,48 112.5,49.5 P5.31
BL0_PD2  (via drill 0.3)
  Top 0.152: P5.32 114,50.25 114,63.25 113.75,63.5 113.75,69.25 114.75,70.25 P4.32 114.75,70.75 113.75,71.75 113.75,90.5 P3.32 114.75,91.75 113.75,92.75 113.75,111.5 P2.32 114.75,112.75 113.75,113.75 113.75,132.5 P1.32 | P17.28 197.1,18.15 v197.1,22.75 | v157.75,23.5 147.75,33.5 147.75,47.75 v146.75,48.75
  Bottom 0.152: v197.1,22.75 196.35,23.5 v157.75,23.5 | v146.75,48.75 146.5,49 140.25,49 138.25,51 116.5,51 115,49.5 P5.32
BL0_PD3  (via drill 0.3)
  Top 0.152: P17.27 199.6,18.15 v199.6,21.35 | v118,24 117.4,24 116.25,25.15 116.25,48.25 117.25,49.25 P5.33 116.25,50.5 116.25,69.25 117.25,70.25 P4.33 117.25,70.75 116.25,71.75 116.25,90.5 P3.33 117.25,91.75 116.25,92.75 116.25,111.5 P2.33 117.25,112.75 116.25,113.75 116.25,132.5 P1.33
  Bottom 0.152: v199.6,21.35 198.95,22 154.25,22 153.25,23 142.5,23 141.5,24 v118,24
BL0_PD4  (via drill 0.3)
  Top 0.152: P1.69 117.25,114.5 118.25,113.5 118.25,107.75 117.25,106.75 P2.69 117.25,106.25 118.25,105.25 118.25,86.5 P3.69 118.25,84.5 118.25,65.75 117.25,64.75 P4.69 117.25,64.25 118.25,63.25 v118.25,51.75 118.25,44.5 P5.69 | P17.62 198.25,16 198.25,25 191.8,31.45 v191.8,36.6 | v168.45,42.2 172,38.65 v172,37.75
  Bottom 0.152: v191.8,36.6 190.65,37.75 v172,37.75 | v168.45,42.2 167.4,43.25 162.75,43.25 158.75,47.25 158.75,48.5 148,48.5 147,49.5 140.25,49.5 138.25,51.5 118.5,51.5 v118.25,51.75
BL0_PD5  (via drill 0.3)
  Top 0.152: P1.68 115.5,126.75 115.5,113.75 115.75,113.5 115.75,107.75 114.75,106.75 P2.68 115,106.25 115,94 115.75,93.25 115.75,86.5 P3.68 115.5,84.75 115.5,71.75 115.75,71.5 115.75,69.25 115,68.5 115,64 | P5.68 115.5,44.25 115.5,48.25 115.75,48.5 115.75,63.25 115,64 | 115,64 114.75,64.25 P4.68 115,64 | P17.63 195.75,16 v195.75,24.75 | v145.2,34.75 143.95,33.5 v143.25,33.5
  Bottom 0.152: v195.75,24.75 195,25.5 193.25,25.5 192.75,25 158.25,25 148.5,34.75 v145.2,34.75 | P5.68 115,43.5 116.5,42 121.25,42 129,34.25 133.5,34.25 134.25,33.5 v143.25,33.5
BL0_PD6  (via drill 0.3)
  Top 0.152: P1.67 113,126.75 113,113.75 113.25,113.5 113.25,107.75 112.25,106.75 P2.67 112.5,106.25 112.5,94 113.25,93.25 113.25,86.5 P3.67 113,84.75 113,71.75 113.25,71.5 113.25,69.25 112.5,68.5 112.5,64 | 112.5,43.75 113,44.25 113,48.25 113.75,49 113.75,49.75 113.5,50 113.5,63 112.5,64 | 112.5,64 112.25,64.25 P4.67 112.5,64 | v145.5,14.25 138.25,21.5 v138.25,27.6 | v113.1,29.65 112.5,30.25 112.5,43.75 | 112.5,43.75 P5.67
  Bottom 0.152: P17.64 195.75,10.5 154.25,10.5 150.5,14.25 v145.5,14.25 | v138.25,27.6 136.2,29.65 v113.1,29.65
BL0_PD7  (via drill 0.3)
  Top 0.152: P1.66 110.5,126.75 110.5,113.75 110.75,113.5 110.75,107.75 109.75,106.75 P2.66 110,106.25 110,94 110.75,93.25 110.75,86.5 P3.66 110.5,84.75 110.5,71.75 110.75,71.5 110.75,69.25 110,68.5 110,64 | 110,64 109.75,64.25 P4.66 110,64 | 110,64 110.75,63.25 110.75,48.5 110.25,48 110.25,44.75 110,44.5 110,43.75 P5.66 109.75,43.25 110.5,42.5 110.5,30.5 v110.7,30.3 | v192.5,9.75 P17.65 | v147.25,13.5 139.25,21.5 v139.25,27.75
  Bottom 0.152: v192.5,9.75 192.25,10 154.25,10 150.75,13.5 v147.25,13.5 | v139.25,27.75 136.7,30.3 v110.7,30.3
BL1_D0
  Top 0.152: P6.49 206.5,126.75 206.5,113.25 206.25,113 206.25,107.75 207.25,106.75 P7.49 207.25,106.25 208.25,105.25 208.25,86.5 P8.49 207.5,85.25 207.5,84.5 207.75,84.25 207.75,72 208.25,71.5 208.25,65.75 207.25,64.75 P9.49 207.25,64.25 208.25,63.25 208.25,44.5 207.5,43.75 | P17.58 210.75,13.5 210.75,38.25 207.5,41.5 207.5,43.75 | 207.5,43.75 P10.49
BL1_D1
  Top 0.152: P6.48 204,126.75 204,113.15 203.75,112.9 203.75,107.75 204.75,106.75 P7.48 204.75,106.25 205.75,105.25 205.75,86.5 P8.48 205.5,84.75 205.5,71.75 205.75,71.5 205.75,65.75 204.75,64.75 P9.48 204.75,64.25 205.75,63.25 205.75,44.5 205,43.75 | P17.23 205,22.75 205,43.75 | 205,43.75 P10.48
BL1_D2
  Top 0.152: P6.47 201.5,126.75 201.5,113.25 201.25,113 201.25,107.75 202.25,106.75 P7.47 202.25,106.25 203.25,105.25 203.25,86.5 P8.47 203.25,84.5 203.25,65.75 202.25,64.75 P9.47 202.25,64.25 203.25,63.25 203.25,44.5 202.5,43.75 | P17.59 208.75,13 208.75,18.5 202.5,24.75 202.5,43.75 | 202.5,43.75 P10.47
BL1_D3
  Top 0.152: P6.46 199,126.75 199,113.35 198.75,113.1 198.75,107.75 199.75,106.75 P7.46 200,106.25 200,105.5 200.75,104.75 200.75,86.5 P8.46 200.5,84.75 200.5,71.75 200.75,71.5 200.75,65.75 199.75,64.75 P9.46 199.75,64.25 201,63 201,50 200.75,49.75 200.75,44.5 200,43.75 | P17.24 200,25.25 200,43.75 | 200,43.75 P10.46
BL1_D4
  Top 0.152: P6.45 196.5,126.75 196.5,113.25 196.25,113 196.25,107.75 197.25,106.75 P7.45 197.25,106.25 198.5,105 198.5,86.75 P8.45 198.25,84.5 198.25,65.75 197.25,64.75 P9.45 197.25,64.25 198.25,63.25 198.25,44.5 197.5,43.75 | P17.60 205.75,13.5 205.75,19 197.5,27.25 197.5,43.75 | 197.5,43.75 P10.45
BL1_D5
  Top 0.152: P6.44 194,126.75 194,113.35 193.75,113.1 193.75,107.75 194.75,106.75 P7.44 194.75,106.25 195.75,105.25 195.75,86.5 P8.44 195.75,84.5 195.75,65.75 194.75,64.75 P9.44 194.75,64.25 195.75,63.25 195.75,44.5 195,43.75 | P17.25 204.75,19.5 195,29.25 195,43.75 | 195,43.75 P10.44
BL1_D6
  Top 0.152: P6.43 191.5,126.75 191.5,113.15 191.2,112.85 191.2,107.8 192.25,106.75 P7.43 192.25,106.25 193.5,105 193.5,86.75 P8.43 193.25,84.5 193.25,65.75 192.25,64.75 P9.43 192.25,64.25 193.25,63.25 193.25,44.5 192.5,43.75 | P17.61 200.75,16 200.75,21.5 199,23.25 199,24.75 192.5,31.25 192.5,43.75 | 192.5,43.75 P10.43
BL1_D7  (via drill 0.3)
  Top 0.152: v191,17.25 190.75,17.5 190.75,42.25 189.75,43.25 P10.42 190.75,44.5 190.75,63.25 189.75,64.25 P9.42 189.75,64.75 190.75,65.75 190.75,84.5 P8.42 189.75,85.75 190.75,86.75 190.75,91.75 191,92 191,105.25 P7.42 189.75,111.11 188.77,112.09 188.77,112.91 189.75,113.89 P6.42
  Bottom 0.152: P17.26 200.75,16.5 191.75,16.5 v191,17.25
BL1_PD0  (via drill 0.3)
  Top 0.152: P6.30 249.75,133.25 248.75,132.25 248.75,113.5 P7.30 248.75,111.5 248.75,103.5 250,102.25 250,91.75 P8.30 249.75,91.25 248.75,90.25 248.75,71.5 P9.30 248.75,69.5 248.75,54.5 249.5,53.75 249.5,49.25 | P17.22 213,18.75 v213,42 | v248.25,45.75 249.5,47 249.5,49.25 | 249.5,49.25 P10.30
  Bottom 0.152: v213,42 213.25,41.75 217,41.75 217.25,41.5 226.75,41.5 228.25,43 228.25,45.75 v248.25,45.75
BL1_PD1  (via drill 0.3)
  Top 0.152: P17.21 216.5,19.75 v216.5,32.55 | v250.75,40.35 251.25,40.85 251.25,48.25 252.25,49.25 P10.31 252.25,49.75 251.25,50.75 251.25,69.5 P9.31 252.25,70.75 251.25,71.75 251.25,90.5 P8.31 252.25,91.75 251.25,92.75 251.25,111.5 P7.31 252.25,112.75 251.25,113.75 251.25,132.5 P6.31
  Bottom 0.152: v216.5,32.55 219.3,32.55 224.25,37.5 248.1,37.5 250.75,40.15 v250.75,40.35
BL1_PD2  (via drill 0.3)
  Top 0.152: P17.20 218.25,19 218.25,40 220.75,42.5 v220.75,45 | P10.32 254.75,49.75 253.75,50.75 253.75,69.5 P9.32 254.75,70.75 253.75,71.75 253.75,90.5 P8.32 254.75,91.75 253.75,92.75 253.75,111.5 P7.32 254.75,112.75 253.75,113.75 253.75,132.5 P6.32
  Bottom 0.152: v220.75,45 222.25,46.5 251.5,46.5 254.5,49.5 P10.32
BL1_PD3  (via drill 0.3)
  Top 0.152: P17.19 220.75,19 220.75,28 v225.2,32.45 | v254.3,40.65 256.25,42.6 256.25,48.25 257.25,49.25 P10.33 257.25,49.75 256.25,50.75 256.25,69.5 P9.33 257.25,70.75 256.25,71.75 256.25,90.5 P8.33 257.25,91.75 256.25,92.75 256.25,111.5 P7.33 257.25,112.75 256.25,113.75 256.25,132.5 P6.33
  Bottom 0.152: v225.2,32.45 229.75,37 250.65,37 v254.3,40.65
BL1_PD4  (via drill 0.3)
  Top 0.152: P6.69 257.25,127.25 258.25,126.25 258.25,107.5 P7.69 257.25,106.25 258.25,105.25 258.25,86.5 P8.69 257.25,85.25 258.25,84.25 258.25,65.5 P9.69 258.25,63.5 258.25,44.75 257.25,43.75 P10.69 257,43.25 257,33.2 v254.8,31 | P17.54 221.25,13 221.25,26.05 v224,28.8
  Bottom 0.152: v224,28.8 224.45,29.25 247.5,29.25 249.25,31 v254.8,31
BL1_PD5  (via drill 0.3)
  Top 0.152: 255,106.25 255.75,105.5 255.75,86.75 254.75,85.75 P8.68 255,85.25 255,84.5 255.75,83.75 255.75,65.5 P9.68 255.5,63.75 255.5,50.75 255.75,50.5 255.75,48.25 255,47.5 255,43.75 P10.68 | P6.68 255.5,126.75 255.5,113.75 255.75,113.5 255.75,111.25 255,110.5 255,106.25 | 255,106.25 P7.68 | P17.55 218.75,13 218.75,39.4 v220.2,40.85
  Bottom 0.152: v220.2,40.85 220.35,41 236.5,41 237.5,42 253,42 254.5,43.5 P10.68
BL1_PD6
  Top 0.152: 252.5,106.25 253.25,105.5 253.25,86.75 252.25,85.75 P8.67 252.5,85.25 252.5,84.5 253.25,83.75 253.25,65.5 P9.67 253,63.75 253,50.75 253.25,50.5 253.25,44.75 252.25,43.75 P10.67 252.25,43.25 253.25,42.25 253.25,17.5 255.75,15 255.75,11 254,11 253,10 219.25,10 P17.56 | P6.67 253,126.75 253,113.75 253.25,113.5 253.25,111.25 252.5,110.5 252.5,106.25 | 252.5,106.25 P7.67
BL1_PD7  (via drill 0.3)
  Top 0.152: 250,106.25 250.75,105.5 250.75,86.75 249.75,85.75 P8.66 250,85.25 250,84.5 250.75,83.75 250.75,65.5 P9.66 250.5,63.75 250.5,50.75 250.75,50.5 250.75,46.75 249.5,45.5 249.5,43.25 | P6.66 250.5,126.75 250.5,113.75 250.75,113.5 250.75,111.25 250,110.5 250,106.25 | 250,106.25 P7.66 | v232,15.75 233.75,17.5 233.75,36.75 v237.5,40.5 | v249.55,40.75 249.5,40.8 249.5,43.25 | 249.5,43.25 P10.66
  Bottom 0.152: P17.57 218.5,15.75 v232,15.75 | v237.5,40.5 237.75,40.75 v249.55,40.75
BL2_D0  (via drill 0.3)
  Top 0.152: 347.5,85.25 347.5,84.5 348.25,83.75 348.25,65.5 P14.49 348.25,63.5 348.25,46.75 347.5,46 347.5,43.75 P15.49 | 347.5,85.25 347.5,89.5 348.25,90.25 348.25,105.5 P12.49 347.25,110.85 348.25,111.85 348.25,113.1 348,113.35 348,126.75 P11.49 | 347.5,85.25 P13.49 | v234.5,14.25 P17.50 | v296,11.75 314,29.75 v314,39
  Bottom 0.152: v234.5,14.25 234.75,14 269,14 271.25,11.75 v296,11.75 | v314,39 314.25,38.75 323.4,38.75 324.9,40.25 343.75,40.25 347,43.5 P15.49
BL2_D1  (via drill 0.3)
  Top 0.152: 345,106.75 345.75,107.5 345.75,125 345,125.75 345,127.25 P11.48 | 345,106.75 345,93.25 345.75,92.5 345.75,90.5 345.5,90.25 345.5,86.25 P13.48 345,85.25 345,83.25 345.75,82.5 345.75,65.5 P14.48 345.5,63.75 345.5,50.75 345.75,50.5 345.75,48.25 344.5,47 344.5,43.25 | 345,106.75 P12.48 | P17.15 232.25,20.5 v232.25,32.5 | v342.5,34.5 344.5,36.5 344.5,43.25 | 344.5,43.25 P15.48
  Bottom 0.152: v232.25,32.5 233.25,33.5 278,33.5 278.6,32.9 284.2,32.9 284.8,33.5 299.4,33.5 299.95,32.95 322.45,32.95 324,34.5 v342.5,34.5
BL2_D2  (via drill 0.3)
  Top 0.152: P11.47 342.25,127.25 343.25,126.25 343.25,107.5 P12.47 342.25,106.25 343.25,105.25 343.25,86.5 P13.47 342.5,85.25 342.5,84.5 343.25,83.75 343.25,69.5 343,69.25 343,65.25 P14.47 343,63.75 343,50.75 343.25,50.5 343.25,48.25 342.5,47.5 342.5,43.75 P15.47 | v314.25,11 319.75,16.5 323.25,16.5 v323.25,39.5
  Bottom 0.152: P17.51 231.25,13.5 269,13.5 271.5,11 v314.25,11 | v323.25,39.5 324.5,40.75 339.25,40.75 342,43.5 P15.47
BL2_D3  (via drill 0.3)
  Top 0.152: 340,85 339.75,85.25 P13.46 340,85 | 340,85 340.75,84.25 340.75,65.5 P14.46 340.5,63.75 340.5,50.75 340.75,50.5 340.75,48.25 339.5,47 339.5,43.25 | 340,106.25 340.75,105.5 340.75,88 340,87.25 340,85 | P11.46 340.5,126.75 340.5,113.75 340.75,113.5 340.75,111.25 340,110.5 340,106.25 | 340,106.25 P12.46 | P17.16 228,18.75 228,30.15 v229.6,31.75 | v338.5,32.5 339.5,33.5 339.5,43.25 | 339.5,43.25 P15.46
  Bottom 0.152: v229.6,31.75 285.25,31.75 285.5,31.5 293.25,31.5 293.75,32 298.5,32 299,31.5 322.9,31.5 323.9,32.5 v338.5,32.5
BL2_D4  (via drill 0.3)
  Top 0.152: 337.5,106.25 338.25,105.5 338.25,86.75 337.25,85.75 P13.45 337.25,85.25 338.25,84.25 338.25,65.5 P14.45 337.5,64.25 337.5,51.25 338.25,50.5 338.25,48.25 337.5,47.5 337.5,43.75 P15.45 | P11.45 338,126.75 338,113.75 338.25,113.5 338.25,108.25 337.5,107.5 337.5,106.25 | 337.5,106.25 P12.45 | v285.75,32.75 v268.25,15.25 | v336,41.75 v336,33.75
  Bottom 0.152: P17.52 230.25,15 236.75,15 237.25,14.5 267.5,14.5 v268.25,15.25 | v285.75,32.75 286,33 299.2,33 299.75,32.45 322.55,32.45 323.85,33.75 v336,33.75 | v336,41.75 337.25,43 P15.45
BL2_D5  (via drill 0.3)
  Top 0.152: P11.44 335.5,126.75 335.5,113.75 335.75,113.5 335.75,107.75 334.75,106.75 P12.44 335.75,105.5 335.75,86.75 334.75,85.75 P13.44 334.75,85.25 335.75,84.25 335.75,65.5 P14.44 335.5,63.75 335.5,50.75 335.75,50.5 335.75,48.25 335,47.5 335,43.25 | P17.17 225.5,18.75 225.5,26.6 v224.8,27.3 | 335,43.25 v335,31.75 | 335,43.25 P15.44
  Bottom 0.152: v224.8,27.3 225.75,28.25 247.5,28.25 247.75,28 290.75,28 293.75,31 294.25,31 294.75,30.5 323.5,30.5 323.75,30.75 332.75,30.75 333.75,31.75 v335,31.75
BL2_D6  (via drill 0.3)
  Top 0.152: 332.5,106.75 333.25,107.5 333.25,125 332.5,125.75 332.5,127.25 P11.43 | 332.5,106.75 332.5,94 333.25,93.25 333.25,86.5 P13.43 332.25,85.25 333.25,84.25 333.25,65.5 P14.43 333,63.75 333,50.75 333.25,50.5 333.25,48.25 332.5,47.5 332.5,43 | 332.5,106.75 P12.43 | P17.53 228.75,16 228.75,26.55 v229.4,27.2 | v333.5,29.5 333.25,29.75 333.25,42.25 332.5,43 | 332.5,43 332.25,43.25 P15.43 332.5,43
  Bottom 0.152: v229.4,27.2 229.45,27.25 259.25,27.25 260,26.5 290.25,26.5 292.75,29 333,29 v333.5,29.5
BL2_D7  (via drill 0.3)
  Top 0.152: P17.18 224.55,20.3 v224.55,25.25 | v297,28.25 298.4,28.25 305.2,35.05 305.2,40.05 v305.4,40.25 | 330,64.25 330.75,63.5 330.75,48.25 330,47.5 330,43.75 P15.42 | 330,85.25 330.75,84.5 330.75,69.25 330,68.5 330,64.25 | 330,64.25 P14.42 | 330,106.25 330.5,105.75 330.5,92.75 330.75,92.5 330.75,88 330,87.25 330,85.25 | 330,85.25 P13.42 | P11.42 330.5,126.75 330.5,113.75 330.75,113.5 330.75,111.25 330,110.5 330,106.25 | 330,106.25 P12.42
  Bottom 0.152: v224.55,25.25 225.3,26 290.25,26 292.5,28.25 v297,28.25 | v305.4,40.25 306.65,41.5 327.5,41.5 329.5,43.5 P15.42
BL2_PD0  (via drill 0.3)
  Top 0.152: P17.14 233,18.75 233,37 v236.4,40.4 | v304.25,59 300.25,55 300.25,48.3 300.23,48.3 295.33,43.4 295.33,43.01 294.75,42.43 v294.75,42 | P14.30 389.75,70.75 388.75,71.75 388.75,90.5 P13.30 389.75,91.75 388.75,92.75 388.75,111.5 P12.30 389.75,112.75 388.75,113.75 388.75,132.5 P11.30
  Bottom 0.152: v236.4,40.4 237.5,41.5 289,41.5 290,40.5 293.25,40.5 v294.75,42 | v304.25,59 304.5,58.75 380.25,58.75 | 380.25,58.75 389.5,49.5 P15.30 | P14.30 388.5,69.25 388.5,58.75 380.25,58.75
BL2_PD1  (via drill 0.3)
  Top 0.152: P12.31 391.25,113.5 391.25,132.25 392.25,133.25 P11.31 | v237.5,15.25 P17.13 | v274,23 v266.25,15.25 | v391.25,38.5 391.25,48.25 392.25,49.25 P15.31
  Bottom 0.152: v266.25,15.25 v237.5,15.25 | v274,23 305.25,23 310.75,28.5 355,28.5 356.25,29.75 383,29.75 391.45,38.2 391.45,38.3 v391.25,38.5 | P15.31 392,49.5 391.5,50 391,50 391,69.25 P14.31 392,70.5 391.5,71 391,71 391,90.25 P13.31 392,91.5 391.5,92 391,92 391,111.25 P12.31
BL2_PD2  (via drill 0.3)
  Top 0.152: P12.32 393.75,113.5 393.75,132.25 394.75,133.25 P11.32 | v246,18.75 248,20.75 v248,28.75 | v331.5,36 v331.5,31.5 | v393.5,41.95 393.75,42.2 393.75,48.25 394.75,49.25 P15.32
  Bottom 0.152: P17.12 238.25,19 245.75,19 v246,18.75 | v248,28.75 249.5,30.25 291.75,30.25 292,30.5 292.75,30.5 293.75,31.5 294.25,31.5 294.75,31 323.2,31 323.45,31.25 331.25,31.25 v331.5,31.5 | v331.5,36 332,36.5 387.35,36.5 392.8,41.95 v393.5,41.95 | P15.32 394.5,49.5 394,50 393.5,50 393.5,69.25 P14.32 394.5,70.5 394,71 393.7,71 393.7,90.45 P13.32 394.5,91.5 394,92 393.7,92 393.7,111.45 P12.32
BL2_PD3  (via drill 0.3)
  Top 0.152: P12.33 396.25,113.5 396.25,132.25 397.25,133.25 P11.33 | P17.11 240.5,18.75 v240.5,34.5 | v299.75,42 v297.75,40
  Bottom 0.152: v240.5,34.5 241.8,35.8 274.3,35.8 279.5,41 289,41 290,40 v297.75,40 | v299.75,42 319.75,42 320.75,43 320.75,46.5 394,46.5 397,49.5 | 397,49.5 396.5,50 396,50 396,69.25 P14.33 397,70.5 396.5,71 396.2,71 396.2,90.45 P13.33 397,91.5 396.5,92 396.2,92 396.2,111.45 P12.33 | 397,49.5 P15.33
BL2_PD4  (via drill 0.3)
  Top 0.152: P11.69 397.25,127.25 398.25,126.25 398.25,107.5 P12.69 397.25,106.25 398.25,105.25 398.25,86.5 P13.69 397.25,85.25 398.25,84.25 398.25,65.5 P14.69 398.25,63.5 398.25,44.75 397.25,43.75 P15.69 | v309.25,10.25 315.75,16.75 315.75,20.5 321.3,26.05 v321.3,26.85
  Bottom 0.152: P17.46 243.75,10.5 259.75,10.5 260.75,11.5 260.75,13 269,13 271.75,10.25 v309.25,10.25 | v321.3,26.85 322.45,28 355,28 356.25,29.25 383.25,29.25 397.25,43.25 P15.69
BL2_PD5  (via drill 0.3)
  Top 0.152: P11.68 394.75,127.25 395.75,126.25 395.75,107.5 P12.68 394.75,106.25 395.75,105.25 395.75,86.5 P13.68 394.75,85.25 395.75,84.25 395.75,65.5 P14.68 395.75,63.5 395.75,44.75 394.75,43.75 P15.68 394.5,43.25 394.5,36 384.5,26 384.5,19.75 383.25,18.5 383.25,17 v379.75,13.5 | P17.47 240,12.25 v240,15.9
  Bottom 0.152: v240,15.9 268.9,15.9 271.25,18.25 285.5,18.25 291.25,12.5 301.75,12.5 302.5,11.75 315.5,11.75 316.75,10.5 357.25,10.5 358.25,11.5 358.25,13.5 v379.75,13.5
BL2_PD6  (via drill 0.3)
  Top 0.152: P11.67 392.25,127.25 393.25,126.25 393.25,107.5 P12.67 392.25,106.25 393.25,105.25 393.25,86.5 P13.67 392.25,85.25 393.25,84.25 393.25,65.5 P14.67 393.25,63.5 393.25,44.75 392.25,43.75 P15.67 | v261,10 279,10 v288.25,19.25 | v295,20.25 306.25,31.5 v306.25,38.5
  Bottom 0.152: P17.48 239.25,10 v261,10 | v288.25,19.25 288.5,19 293.75,19 v295,20.25 | v306.25,38.5 306.5,38.25 386.75,38.25 392,43.5 P15.67
BL2_PD7  (via drill 0.3)
  Top 0.152: P11.66 389.75,127.25 390.75,126.25 390.75,107.5 P12.66 389.75,106.25 390.75,105.25 390.75,86.5 P13.66 389.75,85.25 390.75,84.25 390.75,65.5 P14.66 388.75,63.5 388.75,44.75 389.75,43.75 P15.66 389.5,43.25 389.5,32.6 378.75,21.85 378.75,17.5 373.75,12.5 373.75,10.3 v369.25,5.8 | v267.65,9.15 260.35,9.15 v260.25,9.25
  Bottom 0.152: P17.49 237.5,9.25 v260.25,9.25 | v267.65,9.15 267.65,7.65 269.8,5.5 294.4,5.5 295.49,6.59 306.09,6.59 307.2,7.7 367.35,7.7 v369.25,5.8
CIRAM_1  (via drill 0.3)
  Top 0.152: v35.75,113 35.75,110.75 20,95 20,87.75 12.5,80.25 J1.3
  Bottom 0.152: v35.75,113 48.75,126 85.5,126 87,127.5 P1.57
CIRAM_2  (via drill 0.3)
  Top 0.152: v8.25,83.25 8.25,76.5 9.5,75.25 J1.8
  Bottom 0.152: P2.57 87,106.5 85.5,105 51.25,105 50.75,104.5 29.5,104.5 13.35,88.35 12.55,88.35 8.2,84 8.25,83.95 v8.25,83.25
CIRAM_3
  Bottom 0.152: P3.57 87,85.5 76.25,74.75 19.75,74.75 12.5,67.5 J1.13
CIRAM_4
  Bottom 0.152: P4.57 87,64.5 83.75,61.25 10.75,61.25 9.75,62.25 J1.18
CIRAM_5
  Bottom 0.152: P5.57 87,43.5 85.5,45 41.25,45 41.25,43.25 40,42 35.75,42 35.75,44.75 30.75,49.75 17.5,49.75 12.5,54.75 J1.23
CIRAM_6  (via drill 0.3)
  Top 0.152: v173.75,129 159.9,115.15 159.9,87.65 152.5,80.25 J2.3
  Bottom 0.152: v173.75,129 225.5,129 227,127.5 P6.57
CIRAM_7  (via drill 0.3)
  Top 0.152: v184.5,100.75 v176.5,92.75
  Bottom 0.152: v176.5,92.75 175.75,92.75 175.75,90.25 170.25,84.75 161.95,84.75 153.7,76.5 151,76.5 149.75,75.25 J2.8 | v184.5,100.75 184.75,101 203.25,101 208.25,106 208.25,107.5 210.25,107.5 210.75,107 210.75,105 225.5,105 227,106.5 P7.57
CIRAM_8  (via drill 0.3)
  Top 0.152: v154.5,73 154.5,69.5 152.5,67.5 J2.13 | v226.45,79.05 226.45,80.45 227,81 227,85.25 P8.57
  Bottom 0.152: v154.5,73 218.5,73 224.55,79.05 v226.45,79.05
CIRAM_9
  Bottom 0.152: P9.57 227,64.5 223,60.5 154.5,60.5 154,61 151,61 149.75,62.25 J2.18
CIRAM_10  (via drill 0.3)
  Top 0.152: v154.75,57.25 152.5,55 J2.23
  Bottom 0.152: v154.75,57.25 155,57 165.45,57 171.5,50.95 171.5,49.75 175,49.75 179.75,45 214.75,45 215.75,44 215.75,42.25 217,42.25 217.25,42 225.5,42 227,43.5 P10.57
CIRAM_11  (via drill 0.3)
  Top 0.152: v315.5,118.5 307.5,110.5 307.5,108.75 299.5,100.75 299.5,87.25 292.5,80.25 J3.3
  Bottom 0.152: v315.5,118.5 322.5,125.5 365,125.5 367,127.5 P11.57
CIRAM_12  (via drill 0.3)
  Top 0.152: v365.75,83.25 365.75,91.75 367,93 367,106.25 P12.57
  Bottom 0.152: v365.75,83.25 363,80.5 308,80.5 307.25,81.25 299.75,81.25 295,76.5 291,76.5 289.75,75.25 J3.8
CIRAM_13  (via drill 0.3)
  Top 0.152: v308.25,81.25 308.25,80.75 302.25,74.75 299.75,74.75 292.5,67.5 J3.13
  Bottom 0.152: v308.25,81.25 308.5,81.5 363,81.5 367,85.5 P13.57
CIRAM_14
  Bottom 0.152: P14.57 367,64.5 363.75,61.25 290.75,61.25 289.75,62.25 J3.18
CIRAM_15  (via drill 0.3)
  Top 0.152: v296.5,59 292.5,55 J3.23 | v364.25,52.75 366.25,50.75 366.25,44.75 367.25,43.75 P15.57
  Bottom 0.152: v296.5,59 297.5,58 359,58 v364.25,52.75
CS_1  (via drill 0.3)
  Top 0.152: v122.55,10.45 121.5,11.5 121.5,15.85 121.95,16.3 121.95,41.8 121.25,42.5 121.25,112.75 118,116 v118,125.25
  Bottom 0.152: P18.52 89.5,10.5 122.5,10.5 v122.55,10.45 | v118,125.25 117.25,126 109,126 107.5,127.5 P1.65
CS_2  (via drill 0.3)
  Top 0.152: P18.51 91.8,10.7 94.5,10.7 94.5,12.5 99.5,17.5 99.5,19.55 100.5,20.55 v100.5,20.75 | v117.3,26 118.75,27.45 118.75,46.5 120.75,48.5 120.75,105 v120.5,105.25
  Bottom 0.152: v100.5,20.75 101.25,21.5 112.8,21.5 v117.3,26 | v120.5,105.25 120.25,105 109,105 107.5,106.5 P2.65
CS_3  (via drill 0.3)
  Top 0.152: P18.50 94,13 94,19 91.95,21.05 v91.95,25.8 | v86.75,27 85.5,28.25 85.5,40.75 83.75,42.5 83.75,66.6 v83.8,66.65
  Bottom 0.152: v91.95,25.8 90.75,27 v86.75,27 | v83.8,66.65 84.2,66.25 84.7,66.25 88.25,69.8 88.25,84 105.5,84 107,85.5 P3.65
CS_4
  Top 0.152: P18.49 96.8,10.7 99.5,10.7 99.5,12.5 104.5,17.5 104.5,32.75 107.75,36 107.75,42.25 108.25,42.75 108.25,63.25 107.25,64.25 P4.65
CS_5
  Top 0.152: P18.48 102,16 102,30.75 107,35.75 107,43.25 P5.65
CS_6  (via drill 0.3)
  Top 0.152: v126.75,15.25 127.5,14.5 127.5,13.5 129.5,11.5 v146,11.5 | v175.25,7.75 175.75,8.25 175.75,39 176.25,39.5 176.25,42.5 175.75,43 175.75,50.2 177.25,51.7 v177.25,52.7 | v209.75,57 209.75,60 213.75,64 213.75,67.5 216.25,70 216.25,80 221.25,85 221.25,122 v223.25,124
  Bottom 0.152: P18.47 103.75,15.25 v126.75,15.25 | v146,11.5 146.75,10.75 150,10.75 153,7.75 154,7.75 154.25,8 175,8 v175.25,7.75 | v177.25,52.7 178.05,52.7 182.35,57 v209.75,57 | v223.25,124 223.5,124.25 243.75,124.25 247,127.5 P6.65
CS_7  (via drill 0.3)
  Top 0.152: v105.5,9.5 P18.46 | v138,9.5 v126.25,9.5 | v156.55,17.5 169.5,30.45 v169.5,35 | v174.75,37 174.5,37.25 v174.5,92.5
  Bottom 0.152: v126.25,9.5 v105.5,9.5 | v138,9.5 139.75,11.25 141.5,11.25 145.25,15 152.75,15 155.25,17.5 v156.55,17.5 | v169.5,35 171.5,37 v174.75,37 | v174.5,92.5 180.75,98.75 223.5,98.75 229.75,105 245.5,105 247,106.5 P7.65
CS_8  (via drill 0.3)
  Top 0.152: v211.75,15 213.75,17 213.75,44.5 218.25,49 218.25,70.75 220.5,73 220.5,81.75 v222.75,84
  Bottom 0.152: P18.45 106.6,10.9 110.9,10.9 112,12 112,13 112.35,13.35 127.65,13.35 129.25,11.75 140.75,11.75 146,17 154.25,17 155.5,18.25 164.75,18.25 167.5,15.5 167.5,12.25 174.5,12.25 177.25,15 v211.75,15 | v222.75,84 245.5,84 247,85.5 P8.65
CS_9  (via drill 0.3)